# EAGLE design Track'em V0.1 (EAGLE 8.5.0)
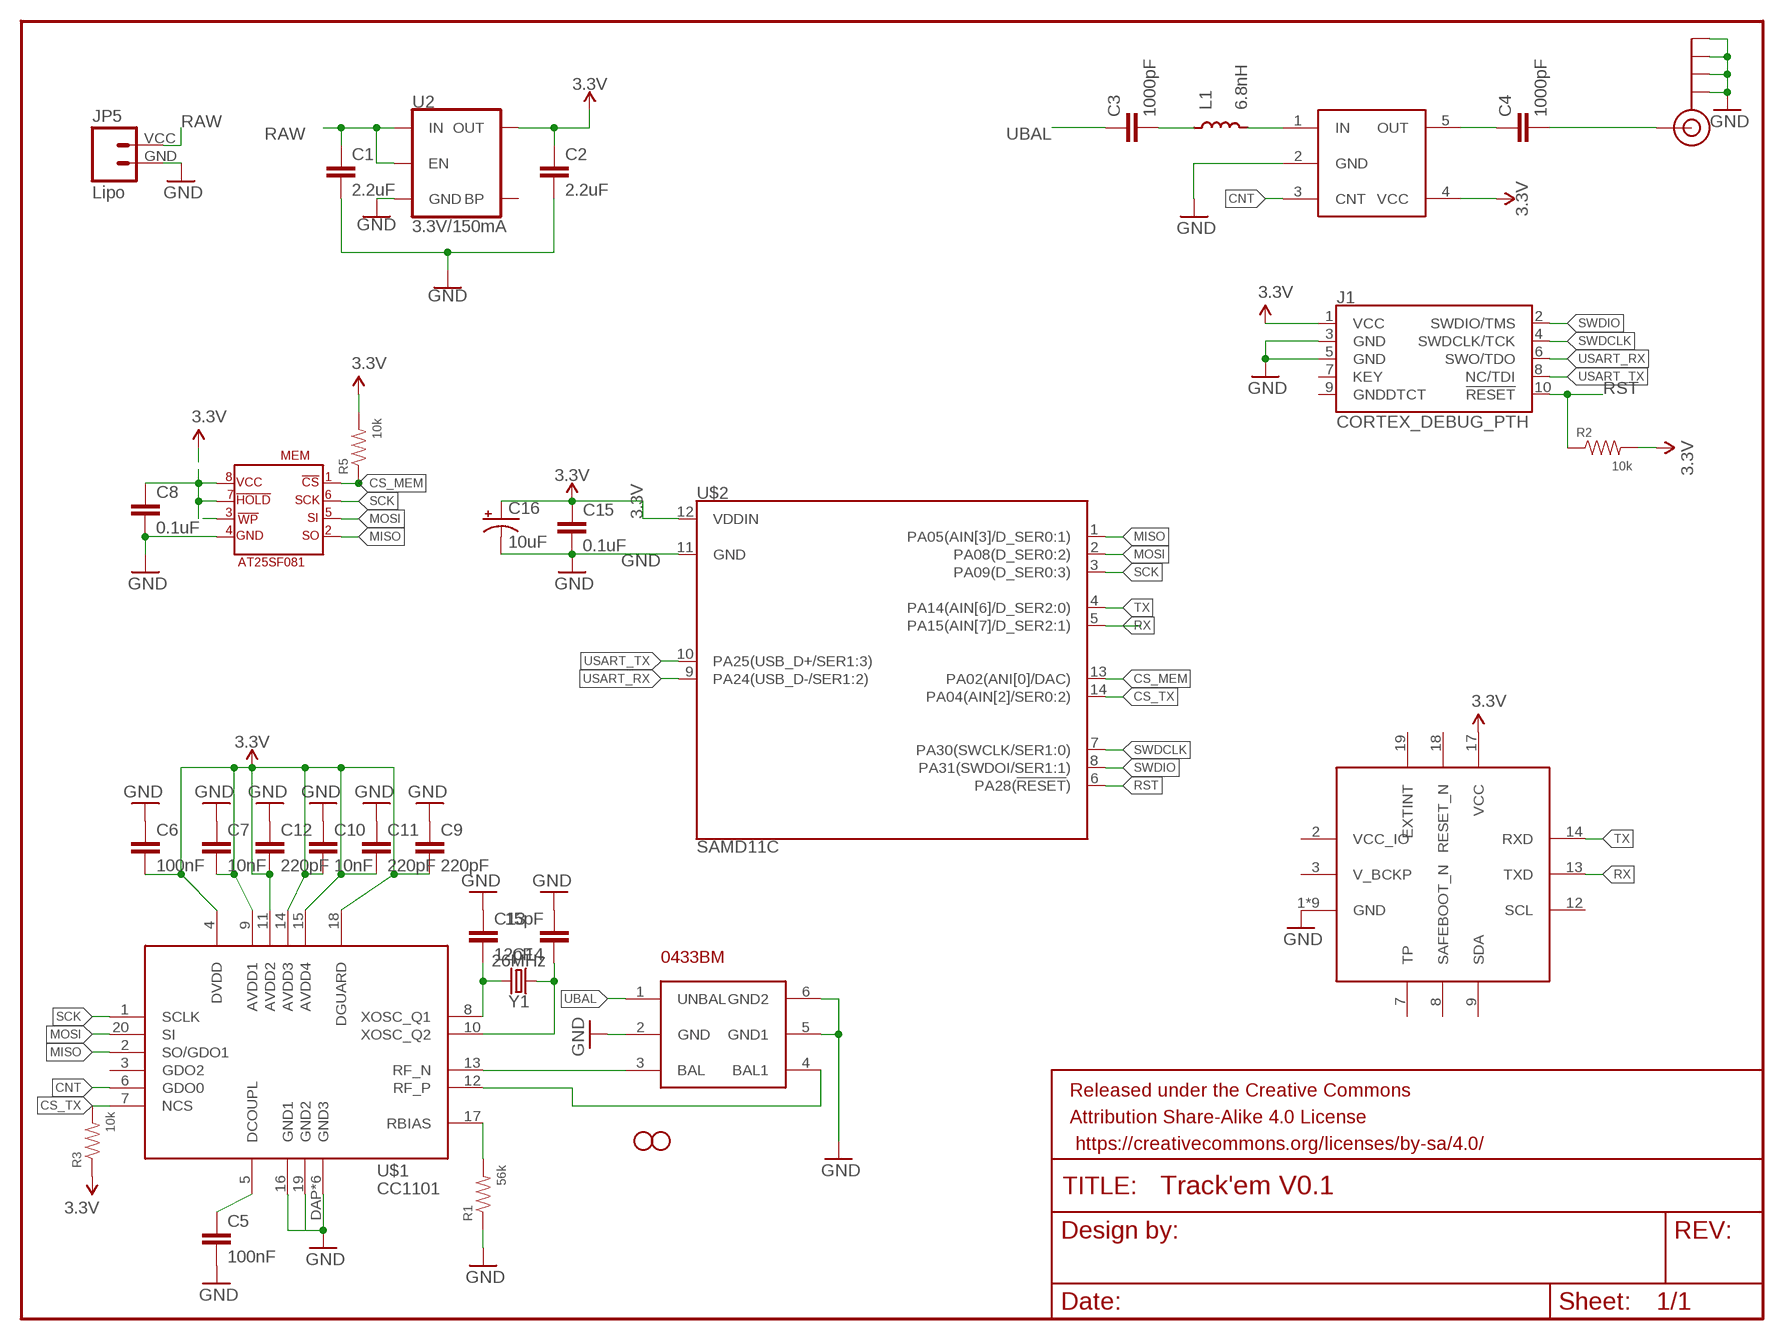
[diagram p0: schematic, sheet 1]

## Parts
C1  2.2uF  2.2UF-0603-10V-20%  [0603]
C2  2.2uF  2.2UF-0603-10V-20%  [0603]
C3  1000pF  2.2UF-0603-10V-20%  [0603]
C4  1000pF  2.2UF-0603-10V-20%  [0603]
C5  100nF  0.1UF-0402-16V-10%  [0402]
C6  100nF  0.1UF-0402-16V-10%  [0402]
C7  10nF  0.1UF-0402-16V-10%  [0402]
C8  0.1uF  0.1UF-0402-16V-10%  [0402]
C9  220pF  0.1UF-0402-16V-10%  [0402]
C10  10nF  0.1UF-0402-16V-10%  [0402]
C11  220pF  0.1UF-0402-16V-10%  [0402]
C12  220pF  0.1UF-0402-16V-10%  [0402]
C13  12pF  0.1UF-0402-16V-10%  [0402]
C14  15pF  0.1UF-0402-16V-10%  [0402]
C15  0.1uF  0.1UF-0402-16V-10%  [0402]
C16  10uF  10UF-6.3V-20%(0603)(TANT)"  [0603-POL]
FRAME1  FRAME-LETTERNO_PACKAGE  [DUMMY]
H1  STAND-OFFTIGHT  [STAND-OFF-TIGHT]
H2  STAND-OFFTIGHT  [STAND-OFF-TIGHT]
IC1  SAM-M8Q  [SAM-M8Q]
J1  CORTEX_DEBUG_PTH  [2X5-PTH-1.27MM]
J$1  SMA_EDGE  [SMA-EDGE]
JP5  Lipo  M024UCON-15767  [JST-2-SMD-VERT]
L1  6.8nH  INDUCTOR0603  [0603]
MEM  AT25SF081  [AT25SF081]
R1  56k  RESISTOR0402  [0402]
R2  10k  RESISTOR0402  [0402]
R3  10k  RESISTOR0402  [0402]
R5  10k  RESISTOR0402  [0402]
U2  3.3V/150mA  V_REG_MIC52053.3V  [SOT23-5]
U$1  CC1101  [CC1101]
U$2  SAMD11C  [SAMD11C]
U$3  0433BM15A0001  [0433BM15A0001]
U$4  AN26018A  [AN26018A]
Y1  26MHz  CRYSTALSMD-3.2X2.5  [CRYSTAL-SMD-3.2X2.5MM]

## Nets
3.3V: C2.1 C6.2 C7.2 C8.1 C9.2 C10.2 C11.2 C12.2 C15.1 C16.A(+) IC1.17(VCC) J1.1(VCC) MEM.!HOLD MEM.!WP MEM.VCC R2.2 R3.1 R5.2 U2.5(OUT) U$1.4(DVDD) U$1.9(AVDD1) U$1.11(AVDD2) U$1.14(AVDD3) U$1.15(AVDD4) U$1.18(DGUARD) U$2.12(VDDIN) U$4.4(VCC)
CNT: U$1.6(GDO0) U$4.3(CNT)
CS_MEM: MEM.!CS R5.1 U$2.13(PA02(ANI[0]/DAC))
CS_TX: R3.2 U$1.7(NCS) U$2.14(PA04(AIN[2]/SER0:2))
GND: C1.2 C2.2 C5.2 C6.1 C7.1 C8.2 C9.1 C10.1 C11.1 C12.1 C13.1 C14.2 C15.2 C16.K(-) IC1.1(GND) IC1.4(GND) IC1.5(GND) IC1.6(GND) IC1.10(GND) IC1.11(GND) IC1.15(GND) IC1.16(GND) IC1.20(GND) J1.3(GND) J1.5(GND) J$1.GND@0(GND) J$1.GND@1(GND) J$1.GND@2(GND) J$1.GND@3(GND) JP5.GND MEM.GND R1.1 U2.2(GND) U$1.16(GND1) U$1.19(GND2) U$1.DAP(GND3) U$1.P$1(GND3) U$1.P$2(GND3) U$1.P$3(GND3) U$1.P$4(GND3) U$1.P$5(GND3) U$2.11(GND) U$3.2(GND) U$3.5(GND1) U$3.6(GND2) U$4.2(GND)
MISO: MEM.SO U$1.2(SO/GDO1) U$2.1(PA05(AIN[3]/D_SER0:1))
MOSI: MEM.SI U$1.20(SI) U$2.2(PA08(D_SER0:2))
N$1: L1.2 U$4.1(IN)
N$2: C3.2 L1.1
N$3: C4.1 U$4.5(OUT)
N$4: C13.2 U$1.8(XOSC_Q1) Y1.3
N$6: C5.1 U$1.5(DCOUPL)
N$7: R1.2 U$1.17(RBIAS)
N$13: C4.2 J$1.SIG(SIGNAL)
N$20: C14.1 U$1.10(XOSC_Q2) Y1.1
RAW: C1.1 JP5.VCC U2.1(IN) U2.3(EN)
RF_N: U$1.13(RF_N) U$3.3(BAL)
RF_P: U$1.12(RF_P) U$3.4(BAL1)
RST: J1.10(!RESET) R2.1 U$2.6(PA28(!RESET!))
RX: IC1.13(TXD) U$2.5(PA15(AIN[7]/D_SER2:1))
SCK: MEM.SCK U$1.1(SCLK) U$2.3(PA09(D_SER0:3))
SWDCLK: J1.4(SWDCLK/TCK) U$2.7(PA30(SWCLK/SER1:0))
SWDIO: J1.2(SWDIO/TMS) U$2.8(PA31(SWDOI/SER1:1))
TX: IC1.14(RXD) U$2.4(PA14(AIN[6]/D_SER2:0))
UBAL: C3.1 U$3.1(UNBAL)
USART_RX: J1.6(SWO/TDO) U$2.9(PA24(USB_D-/SER1:2))
USART_TX: J1.8(NC/TDI) U$2.10(PA25(USB_D+/SER1:3))
Unconnected: IC1.2(VCC_IO) IC1.3(V_BCKP) IC1.7(TP) IC1.8(SAFEBOOT_N) IC1.9(SDA) IC1.12(SCL) IC1.18(RESET_N) IC1.19(EXTINT) J1.7(KEY) J1.9(GNDDTCT) U2.4(BP) U$1.3(GDO2)

## Library data of the parts
C1 C2 = SparkFun-Capacitors:2.2UF: 2.2µF ceramic capacitors A capacitor is a passive two-terminal electrical component used to store electrical energy temporarily in an electric field.; PROD_ID: CAP-07888
C3 C4 = SparkFun-Capacitors:2.2UF: 2.2µF ceramic capacitors A capacitor is a passive two-terminal electrical component used to store electrical energy temporarily in an electric field.; PROD_ID: CAP-07888; VALUE: 2.2uF
C5-C7 C9-C14 = SparkFun-Capacitors:0.1UF: 0.1µF ceramic capacitors A capacitor is a passive two-terminal electrical component used to store electrical energy temporarily in an electric field.; PROD_ID: CAP-12416; VALUE: 0.1uF
C8 C15 = SparkFun-Capacitors:0.1UF: 0.1µF ceramic capacitors A capacitor is a passive two-terminal electrical component used to store electrical energy temporarily in an electric field.; PROD_ID: CAP-12416
C16 = SparkFun-Capacitors:10UF-6.3V-20%(0603)(TANT); PROD_ID: CAP-13210
FRAME1 = SparkFun-Aesthetics:FRAME-LETTER: Schematic Frame - Letter Standard 8.5x11 US Letter frame; DESIGNER: Nobody; VERSION: v01
H1 H2 = SparkFun-Hardware:STAND-OFF: Stand Off Drill holes for mechanically mounting via screws, standoffs, etc. Note: Use the keepout ring to avoid running the screw head into surrounding components. Variant Overviews STAND-OFF - Mechanical footprint for a #4 phillips button head screw. STAND-OFF-TIGHT - Mechanical footprint for a #4 phillips button head screw, Example SparkFun Products Screw - Phillips Head (1/4", 4-40, 10 pack) <https://www.sparkfun.com/products/10453> (PRT-10453) Screw - Phillips Head (1/2", 4-40, 10 pack) <https://www.sparkfun.com/products/10452> (PRT-10452) Screw - Phillips Head (3/4", 4-40, 10 pack) <https://www.sparkfun.com/products/10451> (PRT-10451) Screw - Phillips Head (1", 4-40, 10 pack) <https://www.sparkfun.com/products/10450> (PRT-10450)
IC1 = ubloxLib:SAM-M8Q: u-blox SAM GNSS antenna module
J1 = SparkFun-Connectors:CORTEX_DEBUG: Cortex Debug Connector - 10 pin Supports JTAG debug, Serial Wire debug, and Serial Wire Viewer. PTH and SMD connector options available. General Connector Information <http://infocenter.arm.com/help/topic/com.arm.doc.faqs/attached/13634/cortex_debug_connectors.pdf> Products: PTH Connector <http://www.digikey.com/product-detail/en/cnc-tech/3220-10-0100-00/1175-1627-ND/3883661> -via Digi-Key SparkFun PSoc <https://www.sparkfun.com/products/13229> SparkFun T <https://www.sparkfun.com/products/13810>
J$1 = SparkFun-Connectors:SMA_EDGE: SMA Antenna Connector End launch SMA connector. The paste layer has been removed so that the connector can be hand soldered onto the board after reflow.
JP5 = SparkFun-Connectors:M02: Standard 2-pin 0.1" header. Use with - straight break away headers ( PRT-00116) - right angle break away headers (PRT-00553) - swiss pins (PRT-00743) - machine pins (PRT-00117) - female headers (PRT-00115) Molex polarized connector foot print use with: PRT-08233 with associated crimp pins and housings. 2.54_SCREWTERM for use with PRT-10571. 3.5mm Screw Terminal footprints for PRT-08084 5mm Screw Terminal footprints for use with PRT-08432
L1 = SparkFun-Passives:INDUCTOR: Inductors Basic Inductor/Choke - 0603 and 1206. Footprints are not proven and vary greatly between part numbers. INDUCTOR POWER 3.3UH 4.0A SMD 0.197" L x 0.197" W x 0.177" H (5.00mm x 5.00mm x 4.50mm)
MEM = SaL-lib:AT25SF081: AT25SF081 - 8M memory smd
R1-R3 R5 = SparkFun-Resistors:RESISTOR: Generic Resistor Package
U2 = SparkFun-IC-Power:V_REG_MIC5205: V_REG MIC5205 Standard 3.3V, 5V, and Adjustable 150mA LDO voltage regulator in SOT-23 layout. Micrel part MIC5205. BP (by-pass) pin is used to lower output noise with 470pF cap, may be left open. On the adjustable version BP is used to set output.; PROD_ID: VREG-00822
U$1 = SaL-lib1:CC1101
U$2 = SaL-lib1:SAMD11C
U$3 = SaL-lib1:0433BM15A0001
U$4 = SaL-lib1:AN26018A
Y1 = SparkFun-Clocks:CRYSTAL: Crystals (Generic) These are passive quartz crystals, which can be used as a clock source for a microcontroller. Crystal's are two-terminal devices. They require external "load" capacitors to generate an oscillating signal.

## Board
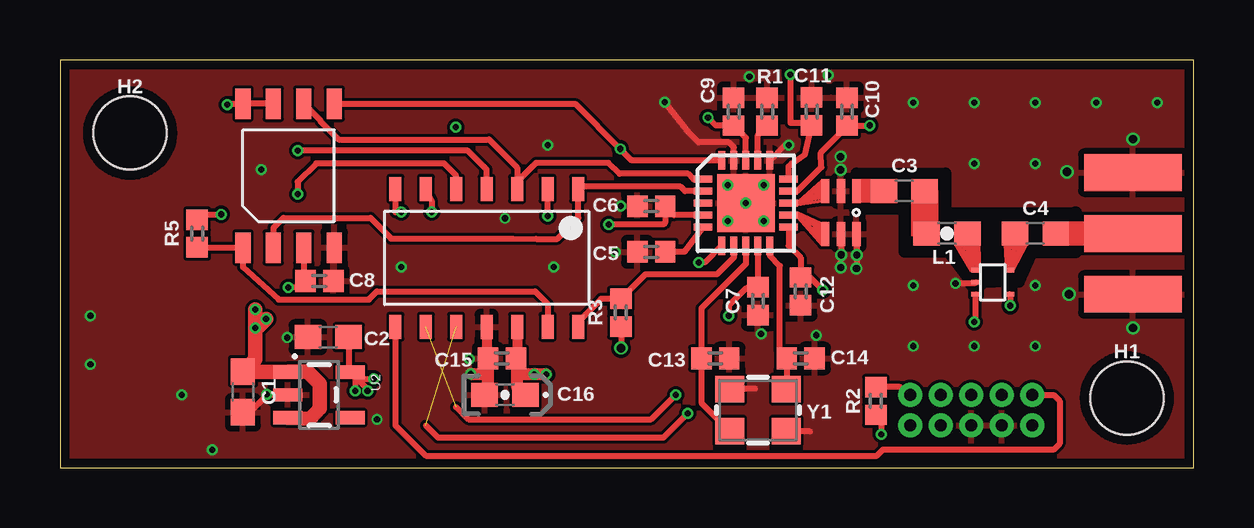
[diagram p1: board, top side]
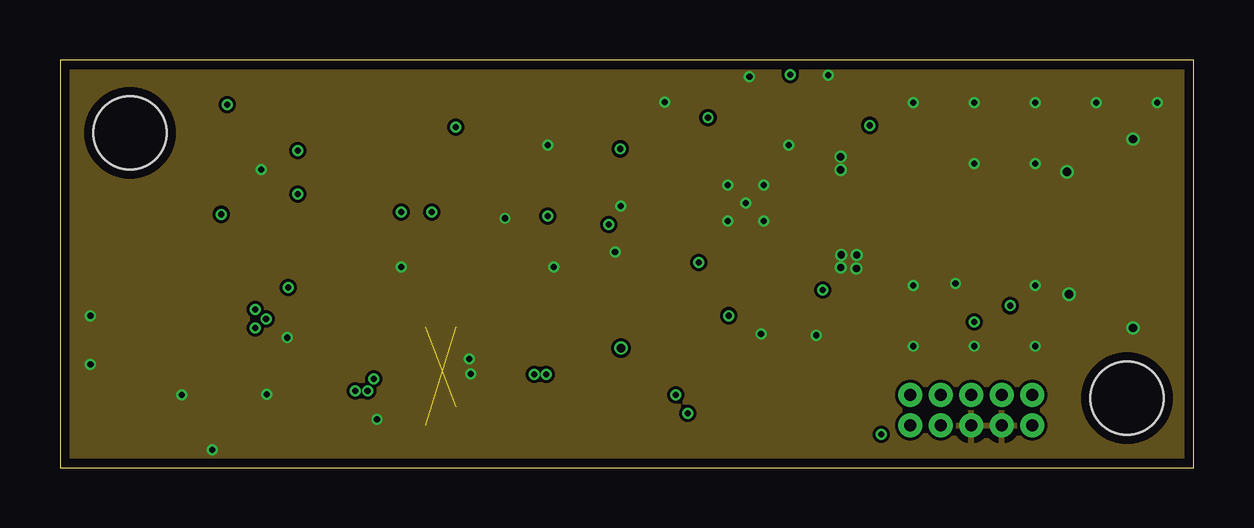
[diagram p2: board, inner layer Route2]
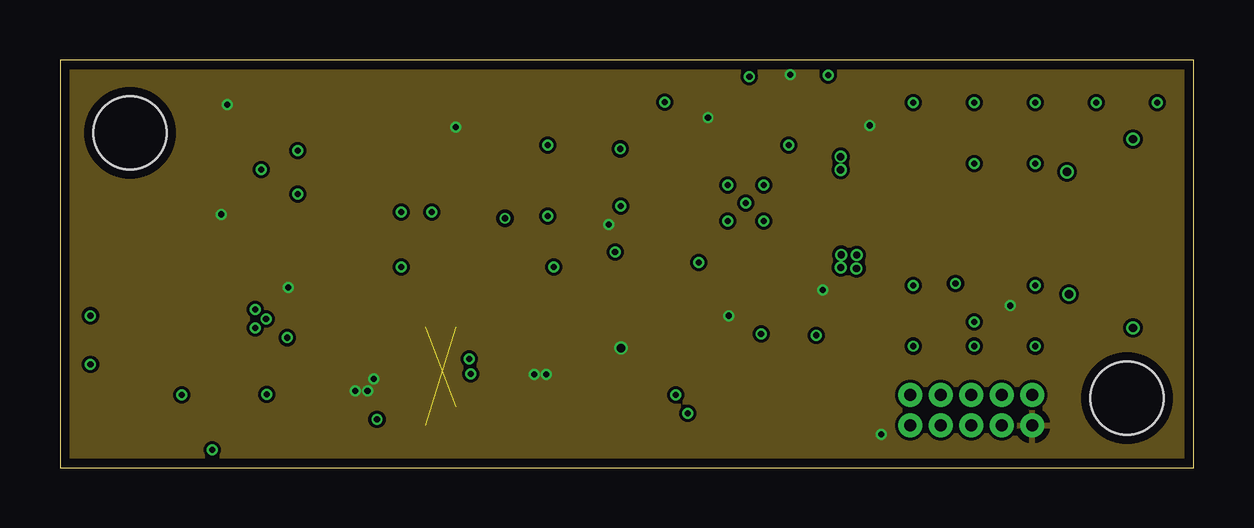
[diagram p3: board, inner layer Route15]
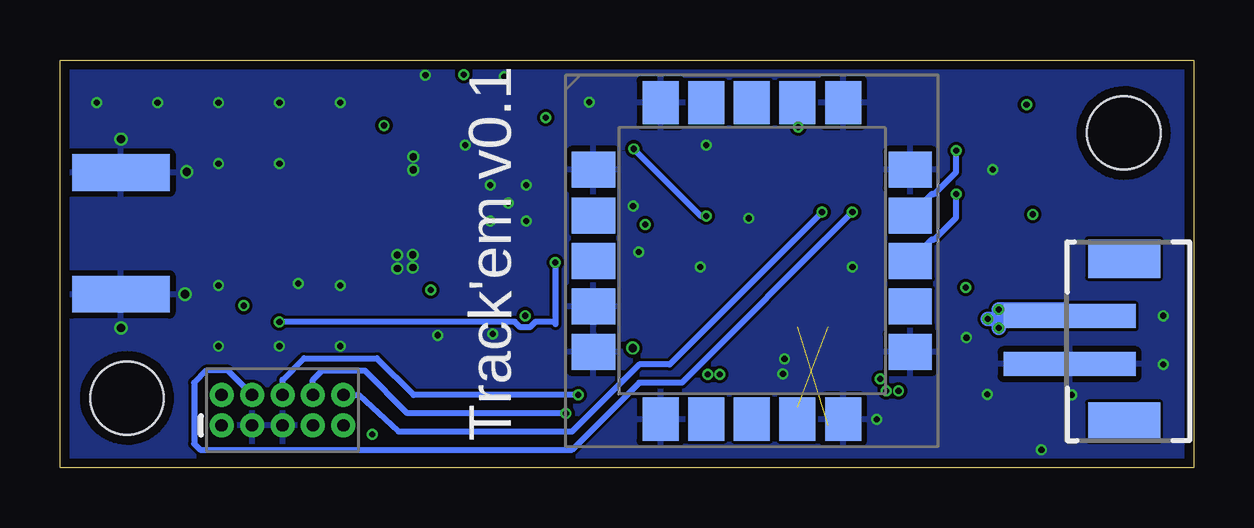
[diagram p4: board, bottom side, seen from below]

Size 47.24 x 17.02 mm. Coordinates in mm from the lower left corner, seen from the top.
Outline: 0,0 47.24,0 47.24,17.02 0,17.02 0,0
Copper layers (1*2*15*16): Top 0.035559375mm / dielectric 0.17018125mm / Route2 0.01778125mm / dielectric 47mil / Route15 0.01778125mm / dielectric 0.17018125mm / Bottom 0.035559375mm
Design rules "oshpark-4layer-tented *": minimum track width 5mil, minimum drill 10mil, track to track 5mil, track to pad 5mil, pad to pad 5mil, via to via 5mil, smd to smd 5mil, copper to edge 15mil, drill to drill 6mil, minimum pad ring 4mil, minimum via ring 4mil, stop-mask expansion 1.5mil, vias tented up to drill 20mil, thermal gap 10mil
tKeepout: area 33,11 to 36.8,12
tRestrict: area 33.1,7.7 to 42.3,12.3

### Footprints (pad centres in the part's own frame; a part is rotated, then mirrored left to right if it is on the bottom)
0603 = smd 1.1 x 1: 1 -0.85,0; 2 0.85,0
0402 = smd 0.85 x 0.9: 1 -0.58,0; 2 0.58,0
0603-POL = smd 1.1 x 1: A 0.85,0; K -0.85,0
STAND-OFF-TIGHT = hole 3.048: 0,0
SAM-M8Q = smd 1.8 x 1.5: 1 -6.6,3.8; 2 -6.6,1.9; 3 -6.6,0; 4 -6.6,-1.9; 5 -6.6,-3.8; 11 6.6,-3.8; 12 6.6,-1.9; 13 6.6,0; 14 6.6,1.9; 15 6.6,3.8 | smd 1.5 x 1.8: 6 -3.8,-6.6; 7 -1.9,-6.6; 8 0,-6.6; 9 1.9,-6.6; 10 3.8,-6.6; 16 3.8,6.6; 17 1.9,6.6; 18 0,6.6; 19 -1.9,6.6; 20 -3.8,6.6
2X5-PTH-1.27MM = drill 0.508 pad 1: 1 -2.54,-0.635; 2 -2.54,0.635; 3 -1.27,-0.635; 4 -1.27,0.635; 5 0,-0.635; 6 0,0.635; 7 1.27,-0.635; 8 1.27,0.635; 9 2.54,-0.635; 10 2.54,0.635
SMA-EDGE = smd 1.524 x 4.064: GND@0 0,0; GND@1 5.08,0; SIG 2.54,0 | smd 1.524 x 4.064 bottom: GND@2 0,0; GND@3 5.08,0
JST-2-SMD-VERT = smd 1 x 5.5: GND 1,-2; VCC -1,-2 | smd 1.6 x 3: P$1 -3.4,0.27; P$2 3.4,0.27
AT25SF081 = smd 1.27 x 0.635: !CS -3,2.54; !HOLD 3,1.27; !WP -3,0; GND -3,-1.27; SCK 3,0; SI 3,-1.27; SO -3,1.27; VCC 3,2.54
SOT23-5 = smd 0.55 x 1.2: 1 -0.95,-1.3; 2 0,-1.3; 3 0.95,-1.3; 4 0.95,1.3; 5 -0.95,1.3
CC1101 = smd 0.76 x 0.28: 1 -1.78,1; 2 -1.78,0.5; 3 -1.78,0; 4 -1.78,-0.5; 5 -1.78,-1; 11 1.78,-1; 12 1.78,-0.5; 13 1.78,0; 14 1.78,0.5; 15 1.78,1 | smd 0.28 x 0.76: 6 -1,-1.78; 7 -0.5,-1.78; 8 0,-1.78; 9 0.5,-1.78; 10 1,-1.78; 16 1,1.78; 17 0.5,1.78; 18 0,1.78; 19 -0.5,1.78; 20 -1,1.78 | smd 2.4 x 2.4: DAP 0,0 | drill 0.254 pad 0.457: P$1 -0.75,0.75; P$2 0.75,0.75; P$3 0.75,-0.75; P$4 -0.75,-0.75; P$5 0,0
SAMD11C = smd 0.5 x 1: 1 -3.81,-2.875; 2 -2.54,-2.875; 3 -1.27,-2.875; 4 0,-2.875; 5 1.27,-2.875; 6 2.54,-2.875; 7 3.81,-2.875; 8 3.81,2.875; 9 2.54,2.875; 10 1.27,2.875; 11 0,2.875; 12 -1.27,2.875; 13 -2.54,2.875; 14 -3.81,2.875
0433BM15A0001 = smd 0.35 x 1: 1 0.65,0.9; 2 0,0.9; 3 -0.65,0.9; 4 -0.65,-0.9; 5 0,-0.9; 6 0.65,-0.9
AN26018A = smd 0.203 x 0.406: 1 -0.5,-0.7; 2 0,-0.7; 3 0.5,-0.7; 4 0.5,0.7; 5 -0.5,0.7
CRYSTAL-SMD-3.2X2.5MM = smd 1.2 x 1.1: 1 -1.175,-0.875; 2 1.175,-0.875; 3 1.175,0.875; 4 -1.175,0.875

### Placement (x,y rotation side)
C1  7.62,3.17 270 top
C2  11.18,5.46 180 top
C3  35.18,11.56 0 top
C4  40.64,9.78 0 top
C5  24.64,9.02 180 top
C6  24.64,10.92 0 top
C7  29.08,6.96 90 top
C8  10.81,7.8 0 top
C9  28.07,14.86 270 top
C10  32.79,14.86 270 top
C11  31.32,14.87 270 top
C12  30.86,7.37 90 top
C13  27.3,4.57 180 top
C14  30.86,4.57 0 top
C15  18.41,4.57 180 top
C16  18.54,3.05 0 top
FRAME1  -13.97,1.27 0 top  (outside the outline)
H1  44.45,2.92 0 top
H2  2.92,13.97 0 top
IC1  18.41,8.64 0 bottom
J1  37.97,2.41 0 bottom
J$1  44.7,12.32 270 top
JP5  3.17,5.33 270 bottom
L1  36.96,9.78 0 top
MEM  10.16,12.19 90 top
R1  29.46,14.86 270 top
R2  34,2.79 270 top
R3  23.37,6.48 90 top
R5  5.71,9.78 90 top
U2  10.79,3.05 270 top
U$1  28.57,11.05 0 top
U$2  17.78,8.76 180 top
U$3  32.54,10.66 0 top
U$4  38.86,7.75 270 top
Y1  29.08,2.41 180 top

### Tracks (layer width: path | path; a pad name or v marks a point on that pad's centre or on a via)
3.3V  (via drill 0.25, 0.35)
  Top 0.152: U$1.14 30.71,11.55 | 32.52,13.98 C10.2
  Top 0.254: v9.51,7.53 9.96,7.53 C8.1 10.16,7.8 MEM.!WP | MEM.!HOLD MEM.VCC 7.01,15.19 v6.97,15.15 | C2.1 12.03,4.07 U2.5 | U2.5 12.37,3.72 v13.07,3.72 | U2.5 12.31,3.79 v12.31,3.21 | U2.5 12.81,3.28 v12.81,3.21 | 19.05,4.32 19.05,4.57 19.05,4.63 | R5.2 5.93,10.58 v6.72,10.58 | 30.71,11.55 31.73,12.55 31.7,13.16 32.52,13.98 | U$1.15 30.36,12.57 30.48,12.7 31.05,13.09 C11.2 31.22,14.39 30.44,14.39 30.44,16.4 v30.43,16.41 | U$1.18 28.57,13.77 C9.2 27.33,14.28 v27,14.61 | C10.2 v33.73,14.28 v33.74,14.29 | U$1.9 29.08,9.26 C7.2 28.8,7.51 28.6,7.51 27.86,6.77 v27.86,6.35 | U$1.11 30.36,9.27 30.37,9.27 30.86,8.78 C12.2 31.26,7.95 v31.79,7.42 | U$1.4 25.59,10.55 C6.2 25.22,10.23 25.15,10.16 v22.86,10.16 | U$4.4 39.59,7.25 v39.59,6.77 | R2.2 34.23,1.99 v34.23,1.4 | R3.1 v23.38,5 | C16.A 19,3.44
  Top 0.406: U$2.12 19.05,4.63 C15.1
  Top 0.508: C16.A 19.05,3.39 19.05,4.06 | 19.05,4.06 19.05,4.57 | 19.05,4.06 19.2,3.91 v19.76,3.91 v20.26,3.91
  Bottom 0.254: IC1.17 16.52,14.21 v16.48,14.21
  pour Route15: 0,0 0,17.02 47.5,17.02 47.5,0
CNT  (via drill 0.25)
  Top 0.254: U$1.6 26.88,8.57 v26.61,8.57 | v38.1,6.1 38.16,6.16 U$4.3
  Bottom 0.254: v26.61,8.57 26.61,6.1 | 26.61,6.1 26.61,6.01 | 26.61,6.1 27.43,6.1 27.66,5.87 28.06,5.87 28.29,6.1 v38.1,6.1
CS_MEM
  Top 0.254: U$2.13 20.32,6.84 19.8,7.37 13.21,7.37 12.87,7.02 9.11,7.02 7.62,8.38 MEM.!CS 5.72,9.19 R5.1
CS_TX
  Top 0.254: U$1.7 28.07,8.78 27.37,8.08 24.39,8.08 R3.2 22.55,7.06 21.59,6.1 U$2.14
GND  (via drill 0.25, 0.3, 0.35)
  Top 0.254: U$3.5 v32.55,8.89 v32.54,8.36 | U$3.6 33.17,9.76 v33.2,8.88 33.2,8.38 v33.19,8.32 | U$1.16 30.21,13.46 v30.37,13.46 | U$1.19 28.07,13.38 27.86,13.59 26.59,13.59 26.21,13.97 v25.2,15.27 | U2.2 8.64,3.05 | 8.64,3.05 v8.61,3.07 | C1.2 7.91,2.33 8.64,3.05 | U$4.2 38.11,7.7 v37.31,7.7 | 31.24,1.52 30.23,1.52 | 28.96,3.3 27.94,3.3
  Top 0.406: U$2.11 17.78,4.63 C15.2
  Top 0.508: C16.K 17.84,3.19 17.84,4.06 | 17.84,4.06 C15.2 | v17.12,3.92 17.7,3.92 17.84,4.06
  other vias: 32.52,12.98 32.52,12.43 17.06,4.55 35.56,15.24 38.1,15.24 38.1,12.7 40.64,12.7 40.64,15.24 43.18,15.24 45.72,15.24 40.64,7.62 40.64,5.08 38.1,5.08 35.56,5.08 35.56,7.62 20.57,8.38 14.22,8.38 8.38,12.45 6.35,0.76 9.47,5.44 28.73,16.32 32.02,16.38 23.37,10.92 23.13,9 29.21,5.59 31.51,5.54 1.27,6.35 1.27,4.32 5.08,3.05 13.21,2.03 18.54,10.41 20.32,13.46 42.04,7.25 44.7,5.84 41.96,12.36 44.7,13.72
  pour Top: 0,0 47.24,0 47.24,17.02 0,17.02
  pour Route2: 0,0 0,17.02 47.5,17.02 47.5,0
  pour Bottom: 0,0 47.5,0 47.5,17.02 0,17.02
MISO
  Top 0.254: U$1.2 26.04,11.55 25.86,11.73 21.69,11.73 21.6,11.65 | 21.6,11.65 U$2.1 | MEM.SO 8.9,9.21 8.9,10.02 9.31,10.43 12.94,10.43 13.79,9.56 18.89,9.56 19.84,9.55 20.73,9.55 21.6,10.43 21.6,11.65
MOSI  (via drill 0.25)
  Top 0.254: U$1.20 23.82,12.83 v23.34,13.31 21.46,15.19 MEM.SI | v20.32,10.52 U$2.2
  Bottom 0.254: v23.34,13.31 20.55,10.52 v20.32,10.52
N$1
  Top 0.127: 38,8.2 37.33,9.32 37.34,9.32 | 37.34,9.32 38.29,9.31 38.32,8.2 38.21,9.23 37.48,9.21 38.04,8.37 38.2,8.38 | 38.2,8.38 38.11,9.14 37.63,9.12 38.09,8.47 38.01,9.04 37.78,9.04 37.97,8.78 37.91,8.97 | U$4.1 38.16,8.34 38.2,8.38 | L1.2 37.35,9.32 37.34,9.32
N$2
  Top 0.254: L1.1 36.11,11.48 C3.2
N$3
  Top 0.127: 39.67,8.39 39.53,8.37 39.45,9.25 40.27,9.32 39.7,8.22 39.42,8.22 39.36,9.34 39.36,9.35 C4.1 | 39.67,8.39 40.12,9.22 39.55,9.14 39.62,8.48 39.97,9.12 39.66,9.07 39.67,8.75 39.8,9.02 | U$4.5 39.56,8.28 39.67,8.39
N$4
  Top 0.254: Y1.3 26.73,2.72 C13.2 26.73,6.66 28.57,8.51 U$1.8
N$6
  Top 0.254: U$1.5 26.02,9.02 C5.1
N$7
  Top 0.254: U$1.17 29.07,13.89 R1.2
N$13
  Top 1.016: C4.2 J$1.SIG
N$20
  Top 0.254: U$1.10 29.57,8.86 30,8.43 30,4.86 C14.1 30.28,3.31 Y1.1
RAW  (via drill 0.25)
  Top 0.61: v8.13,6.6 8.13,5.77 | 7.77,4.17 8.13,4.53 8.13,5.77 | 7.77,4.17 C1.1 | v8.59,6.22 8.13,5.77 | 7.77,4.17 7.94,4 U2.1 9.52,4.03 10.31,4.03 10.82,3.52 10.82,2.5 10.83,2.49 10.43,2.05 U2.3
  Bottom 0.254: JP5.VCC 5.17,6.6 5.45,6.6
  Bottom 0.61: v8.13,6.6 6.86,6.6 | 5.45,6.6 6.86,6.6 | v8.59,6.22 8.13,6.22 | 8.13,6.22 7.24,6.22 6.86,6.6 | v8.13,5.84 8.13,6.22
RF_N
  Top 0.127: U$1.13 30.94,11.05 31.13,11.24 | U$3.3 31.6,11.43 31.59,11.59
  Top 0.152: 31.76,11.99 30.77,11.11 30.75,10.99 31.74,11.14 31.73,11.77 30.89,11.12 31.62,11.25 31.59,11.59 31.47,11.6 31.13,11.24 31.51,11.38 31.5,11.48
RF_P
  Top 0.127: 31.51,10.11 31.7,10.19 30.73,10.63 30.75,10.46 31.75,9.31 31.65,9.62 | 31.65,9.62 31.67,10.1 30.81,10.52 | 30.81,10.52 31.03,10.26 31.55,9.58 31.55,10.06 31.09,10.29 31.5,9.8 31.41,10.03 | U$1.12 30.39,10.52 30.81,10.52 | U$3.4 31.7,9.66 31.65,9.62
RST  (via drill 0.25)
  Top 0.254: J1.10 35,3.37 R2.1 | U$2.6 15.49,11.13 v15.49,10.67
  Bottom 0.254: J1.10 34.8,3.05 33.15,1.52 25.91,1.52 23.11,4.32 21.84,4.32 v15.49,10.67
RX  (via drill 0.25)
  Top 0.254: U$2.5 16.51,12.19 16,12.7 10.67,12.7 9.91,11.94 v9.91,11.43
  Bottom 0.254: IC1.13 10.92,9.53 10.81,9.53 9.91,10.44 v9.91,11.43
SCK
  Top 0.254: U$1.1 26.39,12.05 26.18,12.27 23.32,12.27 22.86,12.72 19.82,12.72 19.05,11.95 | 19.05,11.95 U$2.3 | MEM.SCK 10.86,14.49 10.86,14.45 11.61,13.7 17.88,13.7 19.05,12.54 19.05,11.95
SWDCLK  (via drill 0.25)
  Top 0.254: U$2.7 13.97,10.67 v14.22,10.67
  Bottom 0.254: J1.4 40.26,4.06 41.15,4.06 41.66,3.56 41.66,1.02 41.4,0.76 25.91,0.76 23.11,3.56 21.34,3.56 v14.22,10.67
SWDIO
  Top 0.254: J1.2 41.4,3.05 41.66,2.79 41.66,1.02 41.4,0.76 34.29,0.76 34.04,0.51 15.24,0.51 13.97,1.78 U$2.8
TX  (via drill 0.25)
  Top 0.254: U$2.4 17.78,12.45 17,13.23 v9.91,13.23 9.89,13.23
  Bottom 0.254: IC1.14 10.92,11.43 10.81,11.43 9.91,12.34 v9.91,13.23
UBAL
  Top 0.254: U$3.1 34.32,11.57 C3.1
USART_RX  (via drill 0.25)  (1 unrouted)
  Top 0.254: 16.51,2.54 17.02,2.03 24.64,2.03 v25.65,3.05
  Bottom 0.254: J1.6 37.97,3.68 37.08,4.57 34.04,4.57 32.51,3.05 v25.65,3.05
USART_TX  (via drill 0.25)  (1 unrouted)
  Top 0.254: 15.24,1.78 15.75,1.27 25.15,1.27 v26.16,2.29
  Bottom 0.254: J1.8 36.7,3.68 36.32,4.06 34.54,4.06 32.77,2.29 v26.16,2.29
(copper drawn outside any net)
  shapes: Top area x2

### Text on the board
bNames: Track'em v0.1